# EasyEDA schematic Charging Indicator V1.0.json

## Sheets
1 Sheet_1: TITLE: Battery Charge Indicator; REV: 1.0; Date: 2024-11-25; Sheet: 1/1; Drawn By: dhskinner; Company: David Skinner
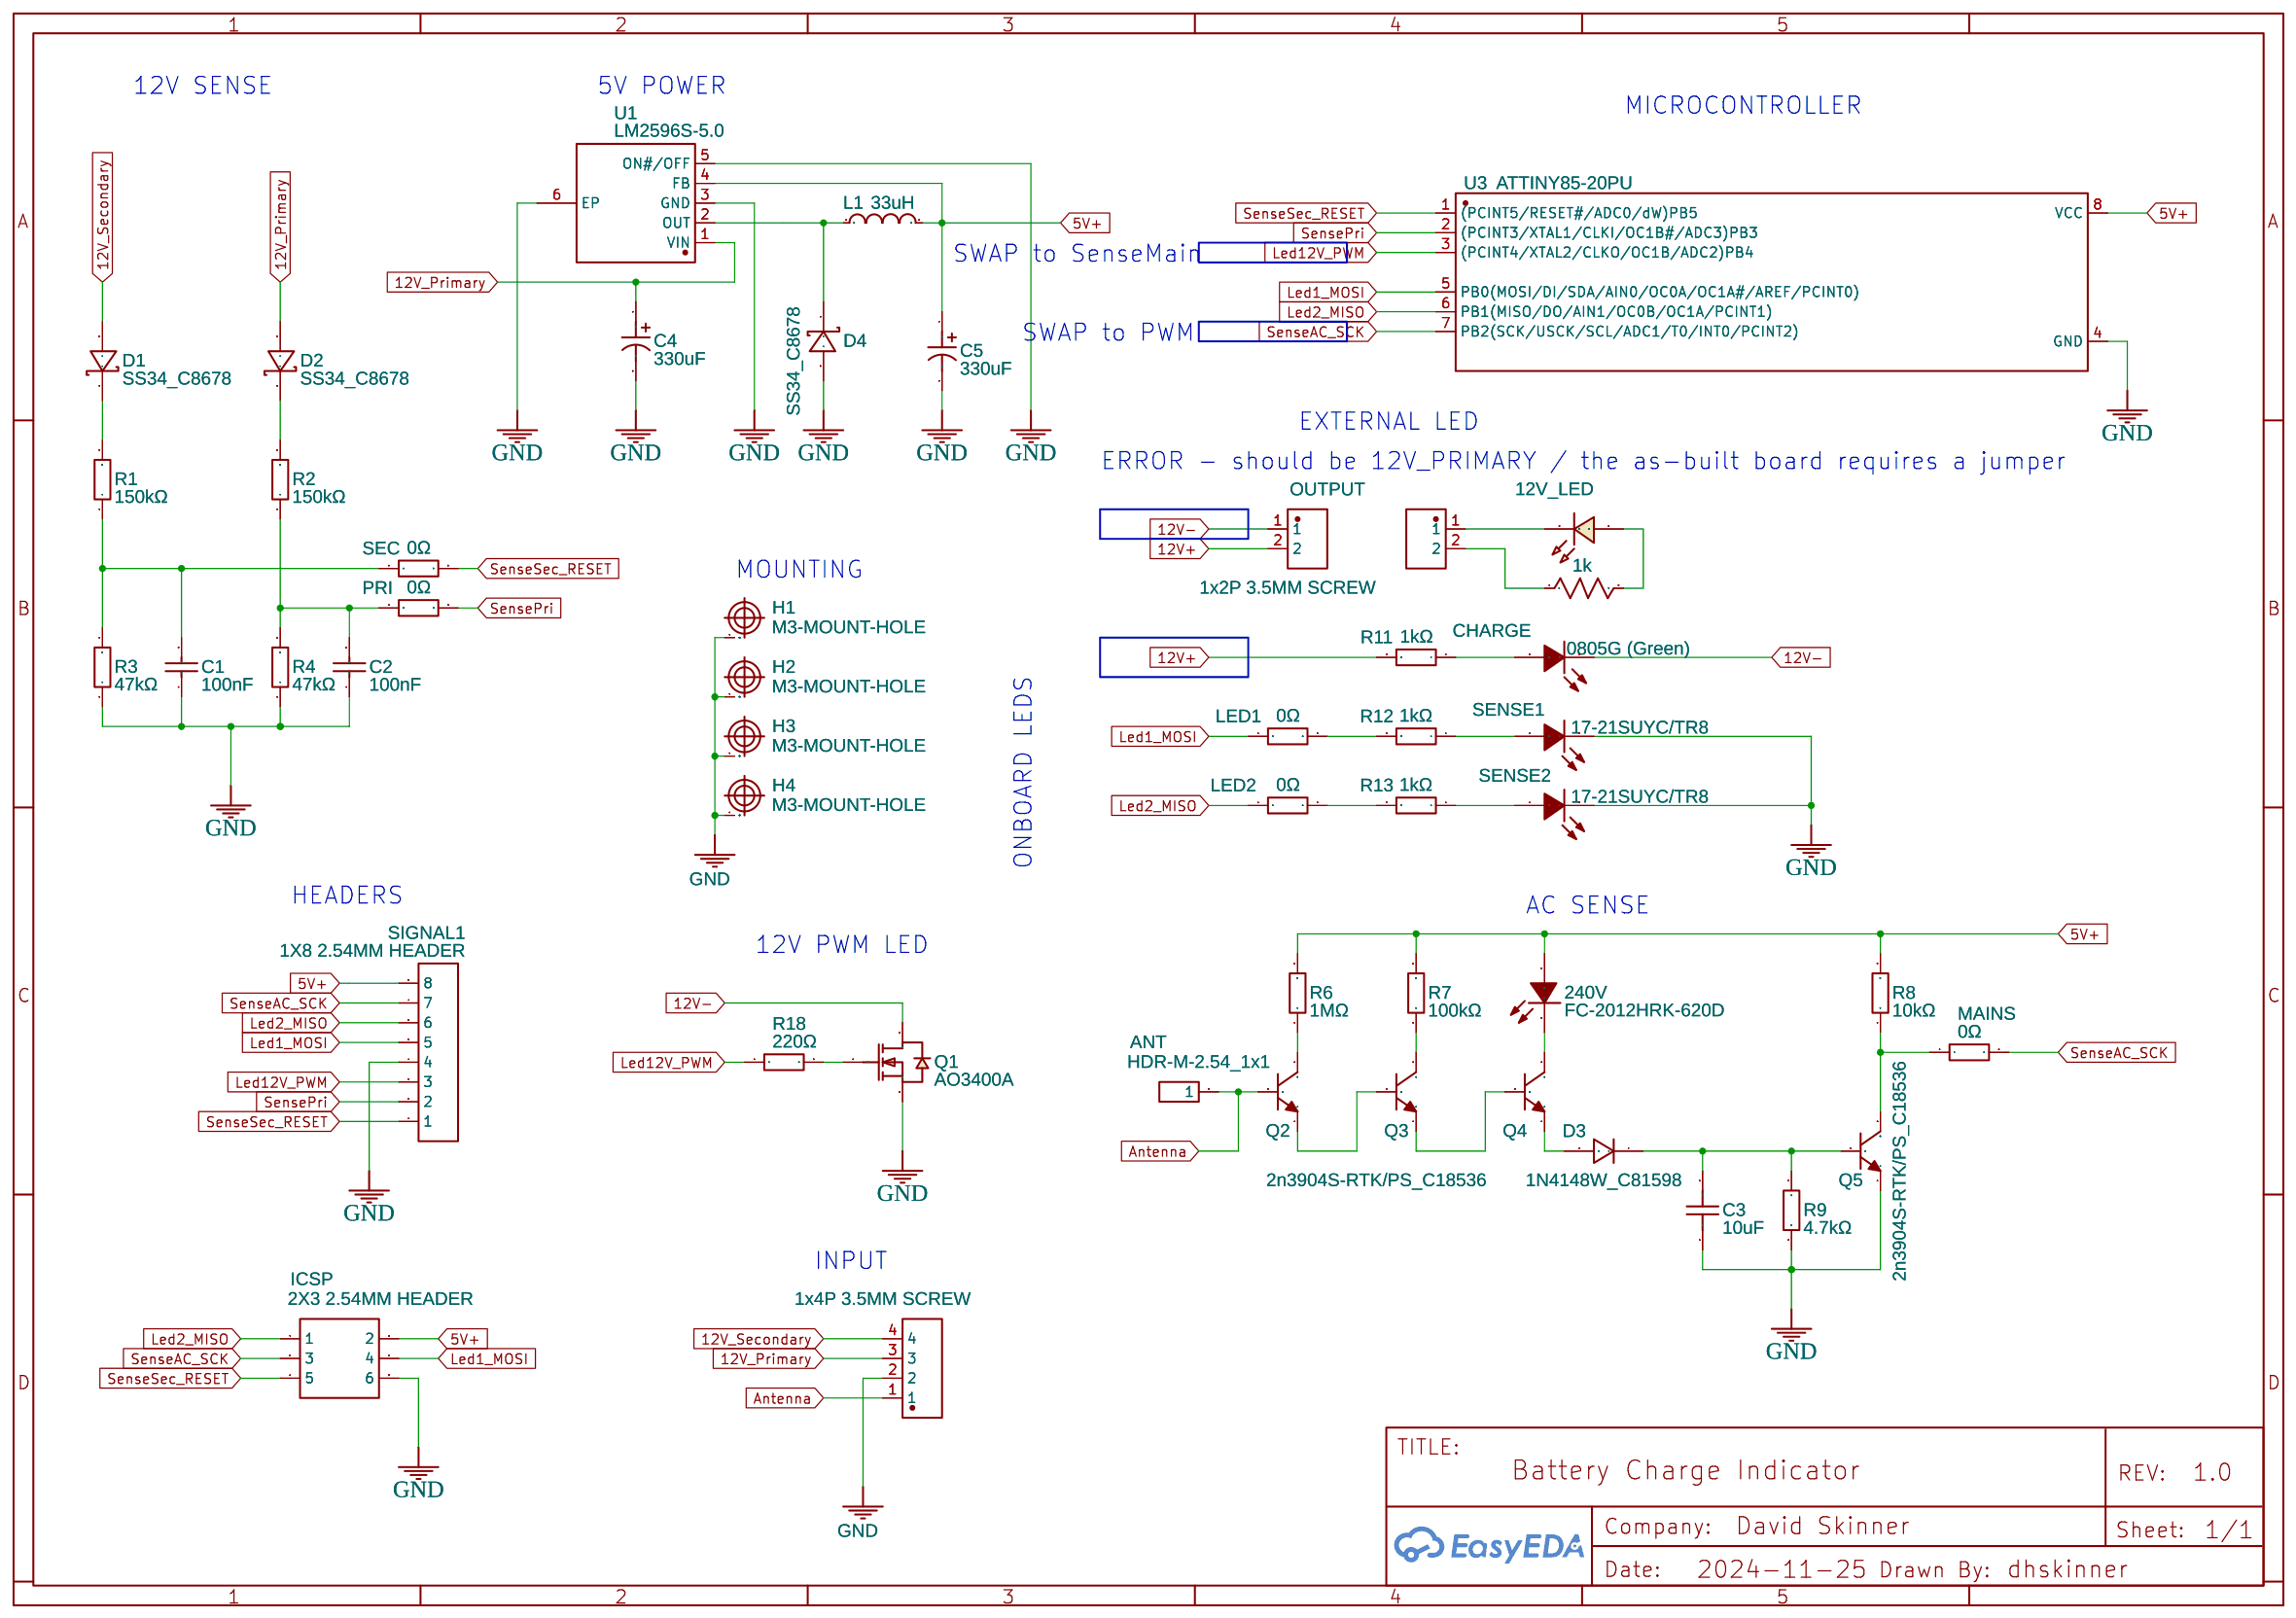
[diagram p0: Sheet_1]
2 Sheet_2: Date: 2024-12-09
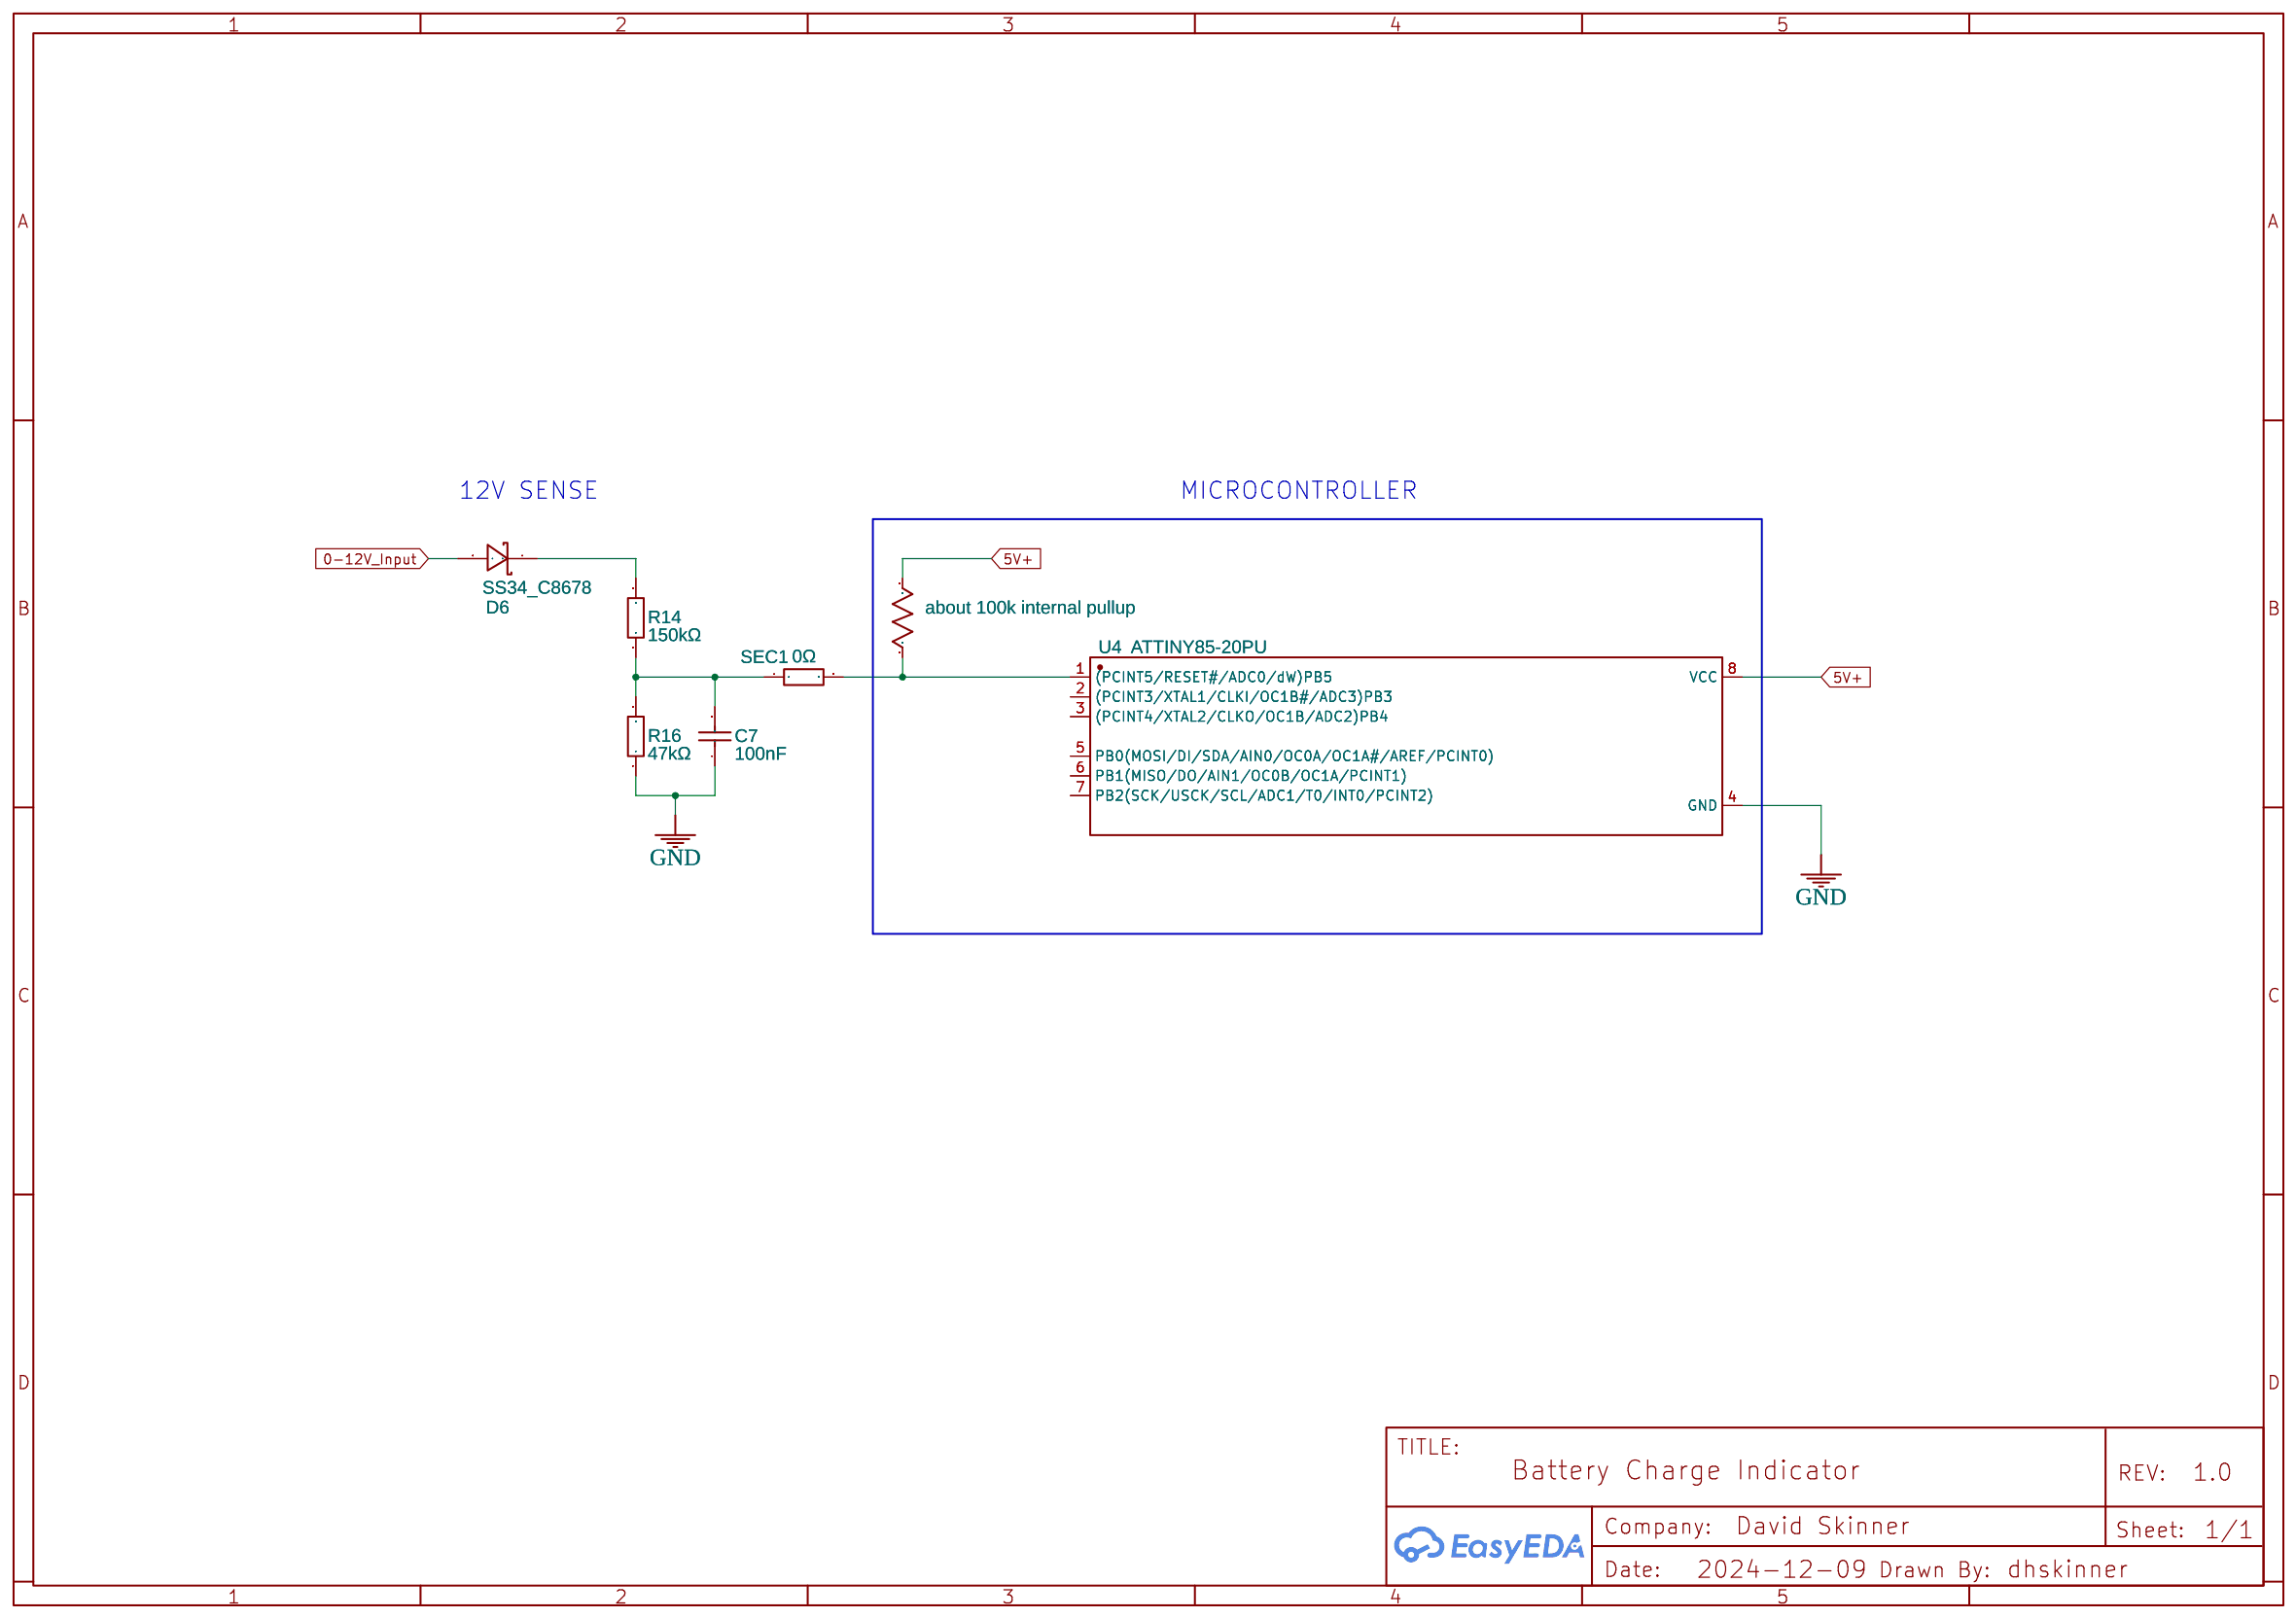
[diagram p1: Sheet_2]
3 Notes: TITLE: Sheet_3; Date: 2026-05-02; Drawn By: plainolddave; Company: Your Company
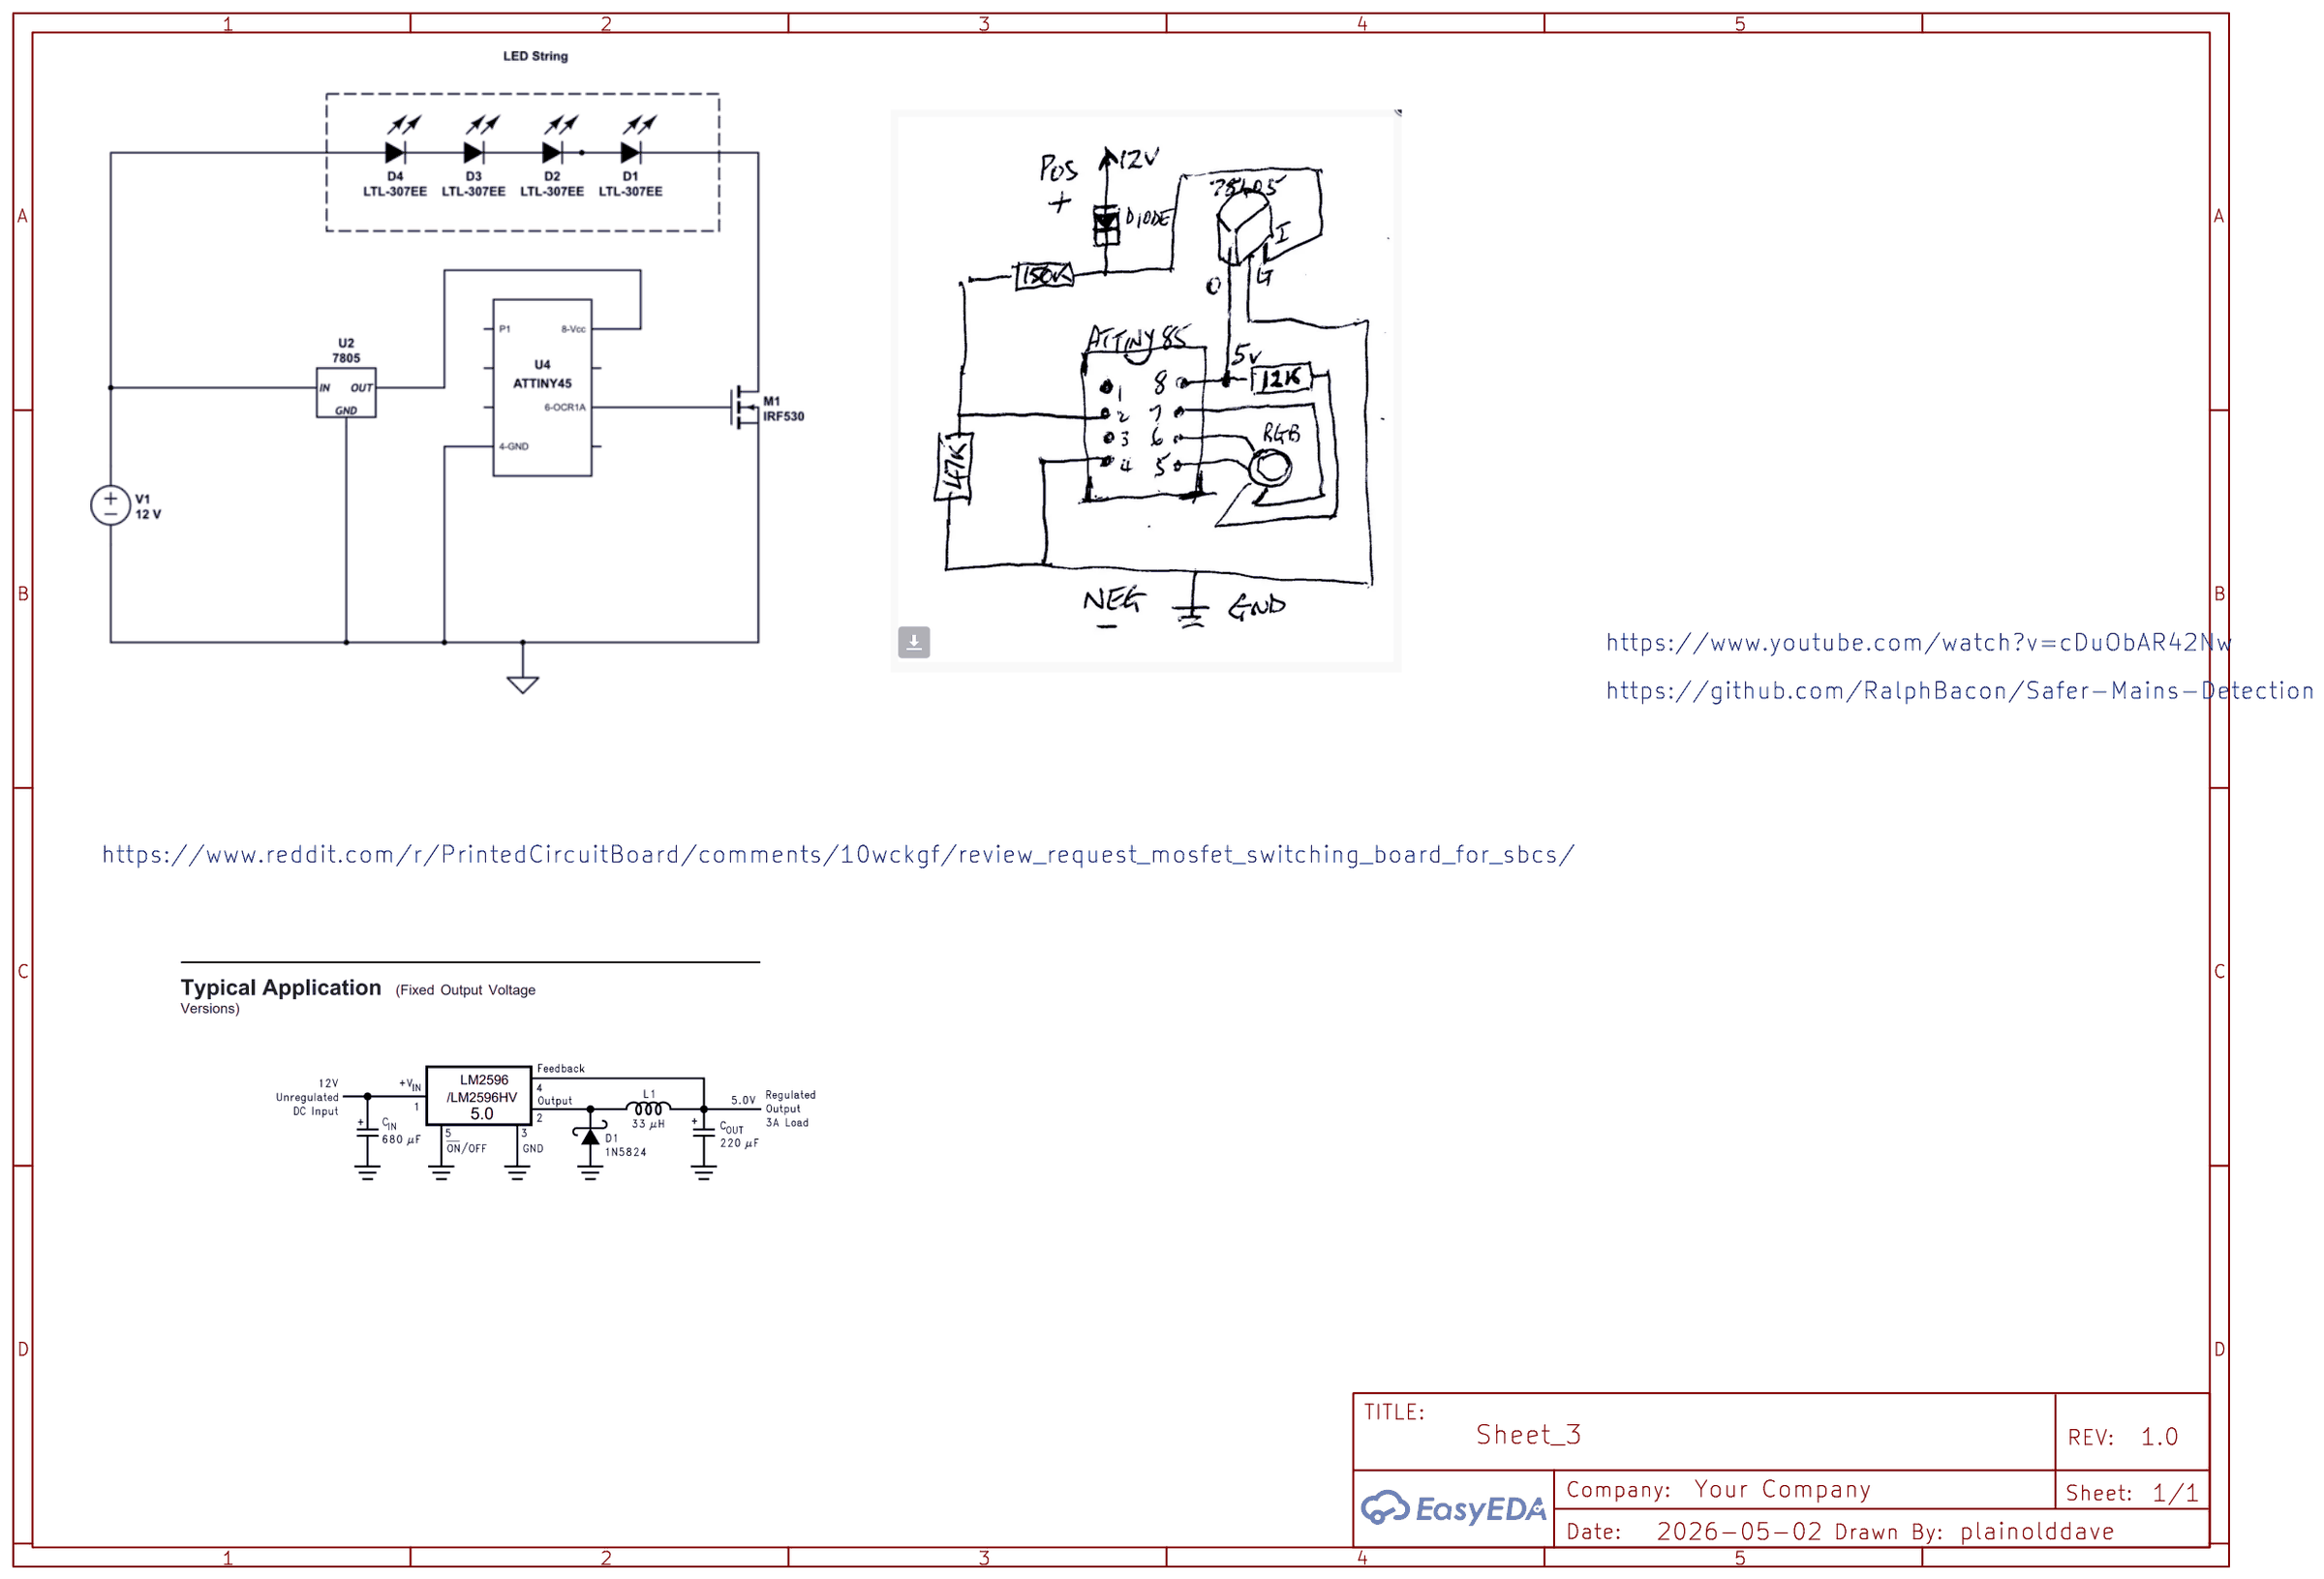
[diagram p2: Notes]

## Parts
sheet Sheet_1
12V_LED  LED-TH-5mm_G  [LED-TH_BD5.0_GREEN]
240V  FC-2012HRK-620D  [LED0805-R-RD]
ANT  HDR-M-2.54_1x1  [HDR-M-2.54_1X1]
C1  100nF  [C0805]
C2  100nF  [C0805]
C3  10uF  [C0603]
C4  330uF  [CAP-SMD_BD6.3-L6.6-W6.6-LS7.6-RD]
C5  330uF  [CAP-SMD_BD6.3-L6.6-W6.6-LS7.6-RD]
CHARGE  0805G (Green)  [LED0805-R-RD]
D1  SS34_C8678  [SMA_L4.3-W2.6-LS5.2-RD]
D2  SS34_C8678  [SMA_L4.3-W2.6-LS5.2-RD]
D3  1N4148W_C81598  [SOD-123F_L2.7-W1.6-LS3.8-RD]
D4  SS34_C8678  [SMA_L4.3-W2.6-LS5.2-RD]
H1  M3-MOUNT-HOLE  [M3-MOUNT-HOLE]
H2  M3-MOUNT-HOLE  [M3-MOUNT-HOLE]
H3  M3-MOUNT-HOLE  [M3-MOUNT-HOLE]
H4  M3-MOUNT-HOLE  [M3-MOUNT-HOLE]
ICSP  2X3 2.54MM HEADER  [HDR-M-2.54_2X3]
INPUT  1x4P 3.5MM SCREW  [CONN-TH_XY350V-3.5-4P]
L1  33uH  [IND-SMD_L12.0-W12.0]
LED1  0Ω  [R0603]
LED2  0Ω  [R0603]
MAINS  0Ω  [R0603]
OUTPUT  1x2P 3.5MM SCREW  [CONN-TH_2P-P3.50_JL124D-35002G01]
PRI  0Ω  [R0603]
Q1  AO3400A  [SOT-23-3_L2.9-W1.3-P1.90-LS2.4-BR]
Q2  2n3904S-RTK/PS_C18536  [SOT-23-3_L2.9-W1.3-P1.90-LS2.4-TR]
Q3  2n3904S-RTK/PS_C18536  [SOT-23-3_L2.9-W1.3-P1.90-LS2.4-TR]
Q4  2n3904S-RTK/PS_C18536  [SOT-23-3_L2.9-W1.3-P1.90-LS2.4-TR]
Q5  2n3904S-RTK/PS_C18536  [SOT-23-3_L2.9-W1.3-P1.90-LS2.4-TR]
R1  150kΩ  [R0805]
R2  150kΩ  [R0805]
R3  47kΩ  [R0805]
R4  47kΩ  [R0805]
R5  1k  [R_AXIAL-0.4]
R6  1MΩ  [R0603]
R7  100kΩ  [R1206]
R8  10kΩ  [R0603]
R9  4.7kΩ  [R1206]
R11  1kΩ  [R0805]
R12  1kΩ  [R0805]
R13  1kΩ  [R0805]
R18  220Ω  [R0603]
SEC  0Ω  [R0603]
SENSE1  17-21SUYC/TR8  [LED0805-R-RD]
SENSE2  17-21SUYC/TR8  [LED0805-R-RD]
SIGNAL1  1X8 2.54MM HEADER  [HDR-M-2.54_1X8]
U1  LM2596S-5.0  [TO-263-5_L10.2-W8.9-P1.70-BR]
U2  JL124D-35002G01  [CONN-TH_2P-P3.50_JL124D-35002G01]
U3  ATTINY85-20PU  [PDIP-8_L9.3-W6.4-P2.54-LS7.9-BL-1]
sheet Sheet_2
C7  100nF  [C0805]
D6  SS34_C8678  [SMA_L4.3-W2.6-LS5.2-RD]
R10  about 100k internal pullup  [R0603]
R14  150kΩ  [R0805]
R16  47kΩ  [R0805]
SEC1  0Ω  [R0603]
U4  ATTINY85-20PU  [PDIP-8_L9.3-W6.4-P2.54-LS7.9-BL-1]

## Library data of the parts
12V_LED = LED-TH-5mm_G: Manufacturer: EVERLIGHT(台湾亿光); Manufacturer Part: 333-2SYGD/S530-E2; Supplier Part: C88163; Supplier: LCSC; Contributor: LCEDA_Lib
240V = FC-2012HRK-620D: Supplier: LCSC; Manufacturer: 国星光电; Manufacturer Part: NCD0805R1; Supplier Part: C84256; JLCPCB Part Class: Basic Part
ANT = HDR-M-2.54_1x1: Supplier Part: C81276; Supplier: LCSC; Contributor: LCEDA_Lib
C1 C2 C7 = CL21B104KCFNNNE: Supplier: LCSC; Manufacturer: SAMSUNG(三星); Supplier Part: C28233; JLCPCB Part Class: Basic Part
C3 = CL10A106MA8NRNC: Supplier: LCSC; Manufacturer: SAMSUNG(三星); Supplier Part: C96446; JLCPCB Part Class: Basic Part
C4 C5 = HV0J337M0605PZ: Supplier: LCSC; Supplier Part: C5246503; Manufacturer: HONOR(荣誉); JLCPCB Part Class: Extended Part; Contributor: lcsc
CHARGE = 0805G (Green): Supplier: LCSC; Manufacturer: KENTO; Manufacturer Part: KT-0805G; Supplier Part: C2297; JLCPCB Part Class: Basic Part
D1 D2 D4 D6 = SS34_C8678: Supplier: LCSC; Manufacturer Part: SS34; Manufacturer: MDD(辰达半导体); Supplier Part: C8678; JLCPCB Part Class: Basic Part
D3 = 1N4148W_C81598: Supplier: LCSC; Manufacturer: ST(先科); Manufacturer Part: 1N4148W; Supplier Part: C81598; JLCPCB Part Class: Basic Part
H1-H4 = M3-MOUNT-HOLE: Contributor: adamalfath
ICSP = HDR-M-2.54_2x3: Supplier Part: C65114; Supplier: LCSC; Contributor: LCEDA_Lib
INPUT = XY350V-3.5-4P: Supplier: LCSC; Supplier Part: C557656; Manufacturer: --; Contributor: LCSC; LCSC Assembly: Yes; SMT Type: Extend; Assembly Type: manualWeld; Paste Type: expand
L1 = SLH1207S330MTT: Contributor: LCSC; Supplier: LCSC; Supplier Part: C181844; Manufacturer: Sunltech(韩国顺磁); JLCPCB Part Class: Extended Part
LED1 LED2 MAINS PRI SEC SEC1 = 0603WAF0000T5E: Supplier: LCSC; Manufacturer: UNI-ROYAL(厚声); Supplier Part: C21189; JLCPCB Part Class: Basic Part
OUTPUT U2 = JL124D-35002G01: Contributor: LCSC; Supplier: LCSC; Supplier Part: C415432; Manufacturer: JILN(锦凌); JLCPCB Part Class: Extended Part
Q1 = AO3400A: Supplier: LCSC; Manufacturer: AOS; Supplier Part: C20917; JLCPCB Part Class: Basic Part
Q2-Q5 = 2n3904S-RTK/PS_C18536: Supplier: LCSC; Manufacturer: KEC; Manufacturer Part: 2N3904S-RTK/PS; Supplier Part: C18536; JLCPCB Part Class: Extended Part
R1 R2 R14 = 0805W8F1503T5E: Supplier: LCSC; Manufacturer: UNI-ROYAL(厚声); Supplier Part: C17470; JLCPCB Part Class: Basic Part
R3 R4 R16 = 0805W8F4702T5E: Supplier: LCSC; Manufacturer: UNI-ROYAL(厚声); Supplier Part: C17713; JLCPCB Part Class: Basic Part
R5 = R_AXIAL-0.4_US: Contributor: LCEDA_Lib
R6 = 0603WAF1004T5E: Supplier: LCSC; Manufacturer: UNI-ROYAL(厚声); Supplier Part: C22935; JLCPCB Part Class: Basic Part
R7 = 1206W4F1003T5E: Supplier: LCSC; Manufacturer: UNI-ROYAL(厚声); Supplier Part: C17900; JLCPCB Part Class: Basic Part
R8 = 0603WAF1002T5E: Supplier: LCSC; Manufacturer: UNI-ROYAL(厚声); Supplier Part: C25804; JLCPCB Part Class: Basic Part
R9 = 1206W4F4701T5E: Supplier: LCSC; Manufacturer: UNI-ROYAL(厚声); Supplier Part: C17936; JLCPCB Part Class: Basic Part
R11-R13 = 0805W8F1001T5E: Supplier: LCSC; Manufacturer: UNI-ROYAL(厚声); Supplier Part: C17513; JLCPCB Part Class: Basic Part
R18 = 0603WAF2200T5E: Supplier: LCSC; Manufacturer: UNI-ROYAL(厚声); Supplier Part: C22962; JLCPCB Part Class: Basic Part
SENSE1 SENSE2 = 17-21SUYC/TR8: Supplier: LCSC; Manufacturer: KENTO; Manufacturer Part: KT-0805黄灯; Supplier Part: C2296; JLCPCB Part Class: Basic Part
SIGNAL1 = HDR-M-2.54_1x8: Supplier Part: C190820; Supplier: LCSC; Contributor: LCEDA_Lib
U1 = LM2596S-5.0: Contributor: LCSC; Supplier: LCSC; Supplier Part: C347421; Manufacturer: UMW(友台半导体); JLCPCB Part Class: Extended Part
U3 U4 = ATTINY85-20PU: Contributor: LCSC; Supplier: LCSC; Supplier Part: C965497; Manufacturer: MICROCHIP(美国微芯); JLCPCB Part Class: Extended Part
R10 = R_0603_US: Contributor: LCEDA_Lib

## Nets
5V+: 240V.1(+) C5.1 ICSP.2 L1.2 R6.2 R7.2 R8.2 R10.2 SIGNAL1.8 U1.4(FB) U3.8(VCC) U4.8(VCC)
12V+: OUTPUT.2 R11.2
12V-: CHARGE.2(K) OUTPUT.1 Q1.3(D)
12V_Primary: C4.1 D2.2(A) INPUT.3 U1.1(VIN)
12V_Secondary: D1.2(A) INPUT.4
GND: C1.1 C2.1 C3.1 C4.2 C5.2 C7.1 D4.2(A) H1.1(GND) H2.1(GND) H3.1(GND) H4.1(GND) ICSP.6 INPUT.2 Q1.2(S) Q5.1(E) R3.1 R4.1 R9.1 R16.1 SENSE1.2(-) SENSE2.2(-) SIGNAL1.4 U1.3(GND) U1.5(ON#/OFF) U1.6(EP) U3.4(GND) U4.4(GND)
0-12V_Input: D6.2(A)
Antenna: ANT.1 INPUT.1 Q2.2(B)
Led1_MOSI: ICSP.4 LED1.1 SIGNAL1.5 U3.5(PB0(MOSI/DI/SDA/AIN0/OC0A/OC1A#/AREF/PCINT0))
Led2_MISO: ICSP.1 LED2.1 SIGNAL1.6 U3.6(PB1(MISO/DO/AIN1/OC0B/OC1A/PCINT1))
Led12V_PWM: R18.1 SIGNAL1.3 U3.3((PCINT4/XTAL2/CLKO/OC1B/ADC2)PB4)
SenseAC_SCK: ICSP.3 MAINS.2 SIGNAL1.7 U3.7(PB2(SCK/USCK/SCL/ADC1/T0/INT0/PCINT2))
SensePri: PRI.2 SIGNAL1.2 U3.2((PCINT3/XTAL1/CLKI/OC1B#/ADC3)PB3)
SenseSec_RESET: ICSP.5 SEC.2 SIGNAL1.1 U3.1((PCINT5/RESET#/ADC0/dW)PB5)
Net-(12V_LED-1): 12V_LED.1 R5.2
Net-(12V_LED-2): 12V_LED.2 U2.1
Net-(240V-2): 240V.2(-) Q4.3(C)
Net-(C1-2): C1.2 R1.1 R3.2 SEC.1
Net-(C2-2): C2.2 PRI.1 R2.1 R4.2
Net-(C3-2): C3.2 D3.1(K) Q5.2(B) R9.2
Net-(C7-2): C7.2 R14.1 R16.2 SEC1.1
Net-(CHARGE-1): CHARGE.1(A) R11.1
Net-(D1-1): D1.1(K) R1.2
Net-(D2-1): D2.1(K) R2.2
Net-(D3-2): D3.2(A) Q4.1(E)
Net-(D4-1): D4.1(K) L1.1 U1.2(OUT)
Net-(D6-1): D6.1(K) R14.2
Net-(LED1-2): LED1.2 R12.2
Net-(LED2-2): LED2.2 R13.2
Net-(MAINS-1): MAINS.1 Q5.3(C) R8.1
Net-(Q1-1): Q1.1(G) R18.2
Net-(Q2-1): Q2.1(E) Q3.2(B)
Net-(Q2-3): Q2.3(C) R6.1
Net-(Q3-1): Q3.1(E) Q4.2(B)
Net-(Q3-3): Q3.3(C) R7.1
Net-(R5-1): R5.1 U2.2
Net-(R10-1): R10.1 SEC1.2 U4.1((PCINT5/RESET#/ADC0/dW)PB5)
Net-(R12-1): R12.1 SENSE1.1(+)
Net-(R13-1): R13.1 SENSE2.1(+)

Not connected (* = marked no-connect by the designer): U4 2((PCINT3/XTAL1/CLKI/OC1B#/ADC3)PB3) 3((PCINT4/XTAL2/CLKO/OC1B/ADC2)PB4) 5(PB0(MOSI/DI/SDA/AIN0/OC0A/OC1A#/AREF/PCINT0)) 6(PB1(MISO/DO/AIN1/OC0B/OC1A/PCINT1)) 7(PB2(SCK/USCK/SCL/ADC1/T0/INT0/PCINT2))

## Notes on the sheets
sheet 1
- 12V SENSE
- 5V POWER
- MICROCONTROLLER
- SWAP to SenseMain
- SWAP to PWM
- EXTERNAL LED
- ERROR - should be 12V_PRIMARY / the as-built board requires a jumper
- MOUNTING
- HEADERS
- ONBOARD LEDS
- AC SENSE
- 12V PWM LED
- INPUT
sheet 2
- 12V SENSE
- MICROCONTROLLER
sheet 3
- https://www.youtube.com/watch?v=cDuObAR42Nw
- https://github.com/RalphBacon/Safer-Mains-Detection
- https://www.reddit.com/r/PrintedCircuitBoard/comments/10wckgf/review_request_mosfet_switching_board_for_sbcs/
